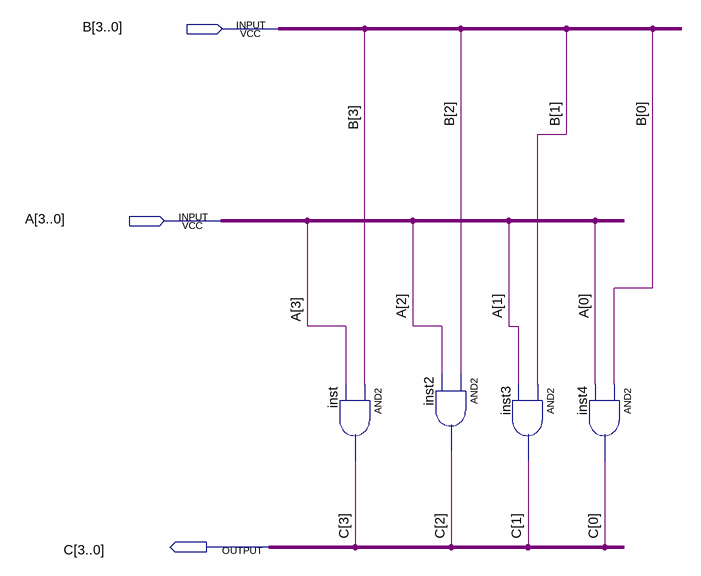
[diagram p0: schematic sheet]
// Quartus schematic portaAND.bdf as structural Verilog: 4 symbols, 3 pins
module portaAND (
  input  [3:0] B,
  input  [3:0] A,
  output [3:0] C
);

  and inst (C[3], B[3], A[3]);
  and inst2 (C[2], B[2], A[2]);
  and inst3 (C[1], B[1], A[1]);
  and inst4 (C[0], B[0], A[0]);
endmodule
